# EAGLE design untitled (EAGLE 9.6.1)
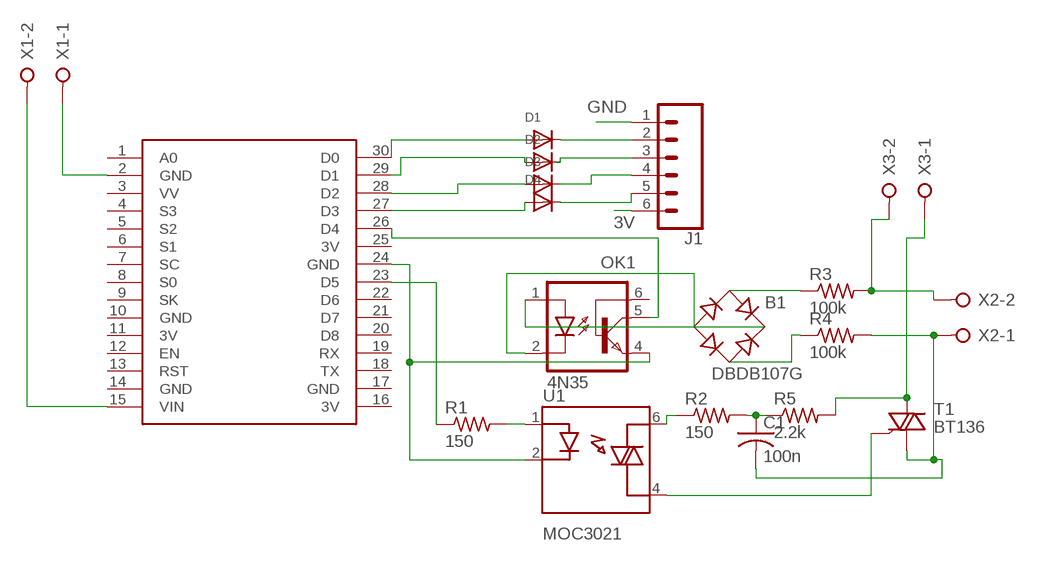
[diagram p0: schematic, sheet 1]

## Parts
B1  DBDB107G  [DB]
C1  100n  C-US050-045X075  [C050-045X075]
D1  DIODEDO-1N4148  [DO-1N4148]
D2  DIODEDO-1N4148  [DO-1N4148]
D3  DIODEDO-1N4148  [DO-1N4148]
D4  DIODEDO-1N4148  [DO-1N4148]
J1  CONN_06LONGPADS  [1X06_LONGPADS]
OK1  4N35  [DIL06]
R1  150  R-US_0207/10  [0207/10]
R2  150  R-US_0207/10  [0207/10]
R3  100k  R-US_0207/10  [0207/10]
R4  100k  R-US_0207/10  [0207/10]
R5  2.2k  R-US_0207/10  [0207/10]
T1  BT136  [TO220AB]
U1  MOC3021  [DIP762W45P254L889H508Q6]
U$1  NODEMCU  [NODEMCU]
X1  W237-02P  [W237-132]
X2  W237-02P  [W237-132]
X3  W237-02P  [W237-132]

## Nets
3V: J1.6
GND: J1.1
N$1: D1.A U$1.30(D0)
N$2: D4.A U$1.27(D3)
N$3: D3.A U$1.28(D2)
N$4: R3.2 X2.2 X3.2
N$5: D3.C J1.4
N$6: U$1.15(VIN) X1.2
N$7: D4.C J1.5
N$8: D1.C J1.2
N$9: U$1.2(GND) X1.1
N$10: D2.A U$1.29(D1)
N$11: D2.C J1.3
N$12: B1.AC1 R3.1
N$14: B1.AC2 R4.1
N$15: T1.3(G) U1.4(MAIN_TERM2)
N$16: B1.- OK1.2(C)
N$17: B1.+ OK1.1(A)
N$18: OK1.4(EMI) U1.2(CATODE) U$1.24(GND)
N$19: OK1.5(COL) U$1.26(D4)
N$20: R1.1 U$1.23(D5)
N$21: R1.2 U1.1(ANODE)
N$22: R2.1 U1.6(MAIN_TERM1)
N$23: C1.1 R2.2 R5.1
N$24: R5.2 T1.2(A2) X3.1
N$25: C1.2 R4.2 T1.1(A1) X2.1
Unconnected: OK1.6(BAS) U$1.1(A0) U$1.3(VV) U$1.4(S3) U$1.5(S2) U$1.6(S1) U$1.7(SC) U$1.8(S0) U$1.9(SK) U$1.12(EN) U$1.13(RST) U$1.18(TX) U$1.19(RX) U$1.20(D8) U$1.21(D7) U$1.22(D6)

## Power pins joined to a net without a drawn wire
3V: U$1.11(3V) U$1.16(3V) U$1.25(3V)
GND: U$1.10(GND) U$1.14(GND) U$1.17(GND)

## Library data of the parts
B1 = rectifier:DB?*G: Single Phase 1.0 AMP Glass Passivated Bridge Rectifier Taiwan Semiconductor Co.,Ltd. - TSC Source: http://www.taiwansemi.com/TSCbig5/ezcatfiles/cust/img/img/db101g.pdf http://www.ts.com.tw/db/pictures/modules/PDT/PDT060207001/DBLS201G.pdf
C1 = adafruit:C-US: CAPACITOR, American symbol
D1-D4 = adafruit:DIODE: Diode SMADIODE - SMA Surface Mount Package 20V 1A Schottky Diode Digikey: 641-1014-6-ND DO-1N4148 - Through Hole Small Current Diode SOD-123 20V 1 A (.5mV Vf) Schottky Diode - Digikey: MBRX120TPMSCT-ND SOD-323 10V 570mA (.38mV Vf, 3ns) Schottky Diode - Digikey: ZLLS410CT-ND SOD-523 30V 30mA Schottky Diode (RB751S-40TE61) - Digikey: RB751S-40TE61CT-ND SOT23-R/W - SOT23 Package (R = Solder Paste/Reflow Ovens, W = Hand-Soldering) BAT54Film 40V 300mA - Digikey: 497-7162-1-ND
J1 = SparkFun-Connectors:CONN_06: Multi connection point. Often used as Generic Header-pin footprint for 0.1 inch spaced/style header connections On any of the 0.1 inch spaced packages, you can populate with these: Break Away Headers - Straight <https://www.sparkfun.com/products/116> (PRT-00116) Break Away Male Headers - Right Angle <https://www.sparkfun.com/products/553> (PRT-00553) Female Headers <https://www.sparkfun.com/products/115> (PRT-00115) Break Away Headers - Machine Pin <https://www.sparkfun.com/products/117> (PRT-00117) Break Away Female Headers - Swiss Machine Pin <https://www.sparkfun.com/products/743> (PRT-00743) Arduino Stackable Header - 6 Pin <https://www.sparkfun.com/products/9280> (PRT-09280) For SCREWTERMINALS and SPRING TERMINALS visit here: Screw Terimnals on SparkFun.com <https://www.sparkfun.com/search/results?term=Screw+Terminals> (5mm/3.5mm/2.54mm spacing) This device is also useful as a general connection point to wire up your design to another part of your project. Our various solder wires solder well into these plated through hole pads. Hook-Up Wire - Assortment (Stranded, 22 AWG) <https://www.sparkfun.com/products/11375> (PRT-11375) Hook-Up Wire - Assortment (Solid Core, 22 AWG) <https://www.sparkfun.com/products/11367> (PRT-11367) View the entire wire category on our website here <https://www.sparkfun.com/categories/141>
OK1 = optocoupler:4N35: MOTOROLA OPTO COUPLER; MF: FAIRCHILD SEMICONDUCTOR; MPN: 4N35; OC_FARNELL: 1328375; OC_NEWARK: 72K9946
R1-R5 = adafruit:R-US_: RESISTOR, American symbol
T1 = triac:BT136: Triac BT136 series E sensitive gate Source: http://www.nxp.com/acrobat_download/datasheets/BT136_SERIES_E_2.pdf
U1 = MOC3021:MOC3021: Optocoupler Triac AC-OUT 1-CH 400VDRM 6-Pin PDIP; AVAILABILITY: Unavailable; DESCRIPTION: Optoisolator Triac Output 4170Vrms 1 Channel 6-SMD; DIGIKEY-PURCHASE-URL: https://snapeda.com/shop?store=DigiKey&id=1666329; MF: ON Semiconductor; MP: MOC3021; PACKAGE: DIP-6 Fujitsu; PRICE: None
U$1 = nodemcu:NODEMCU
X1-X3 = con-wago-508:W237-02P: WAGO SREW CLAMP; OC_FARNELL: unknown; OC_NEWARK: unknown

## Board
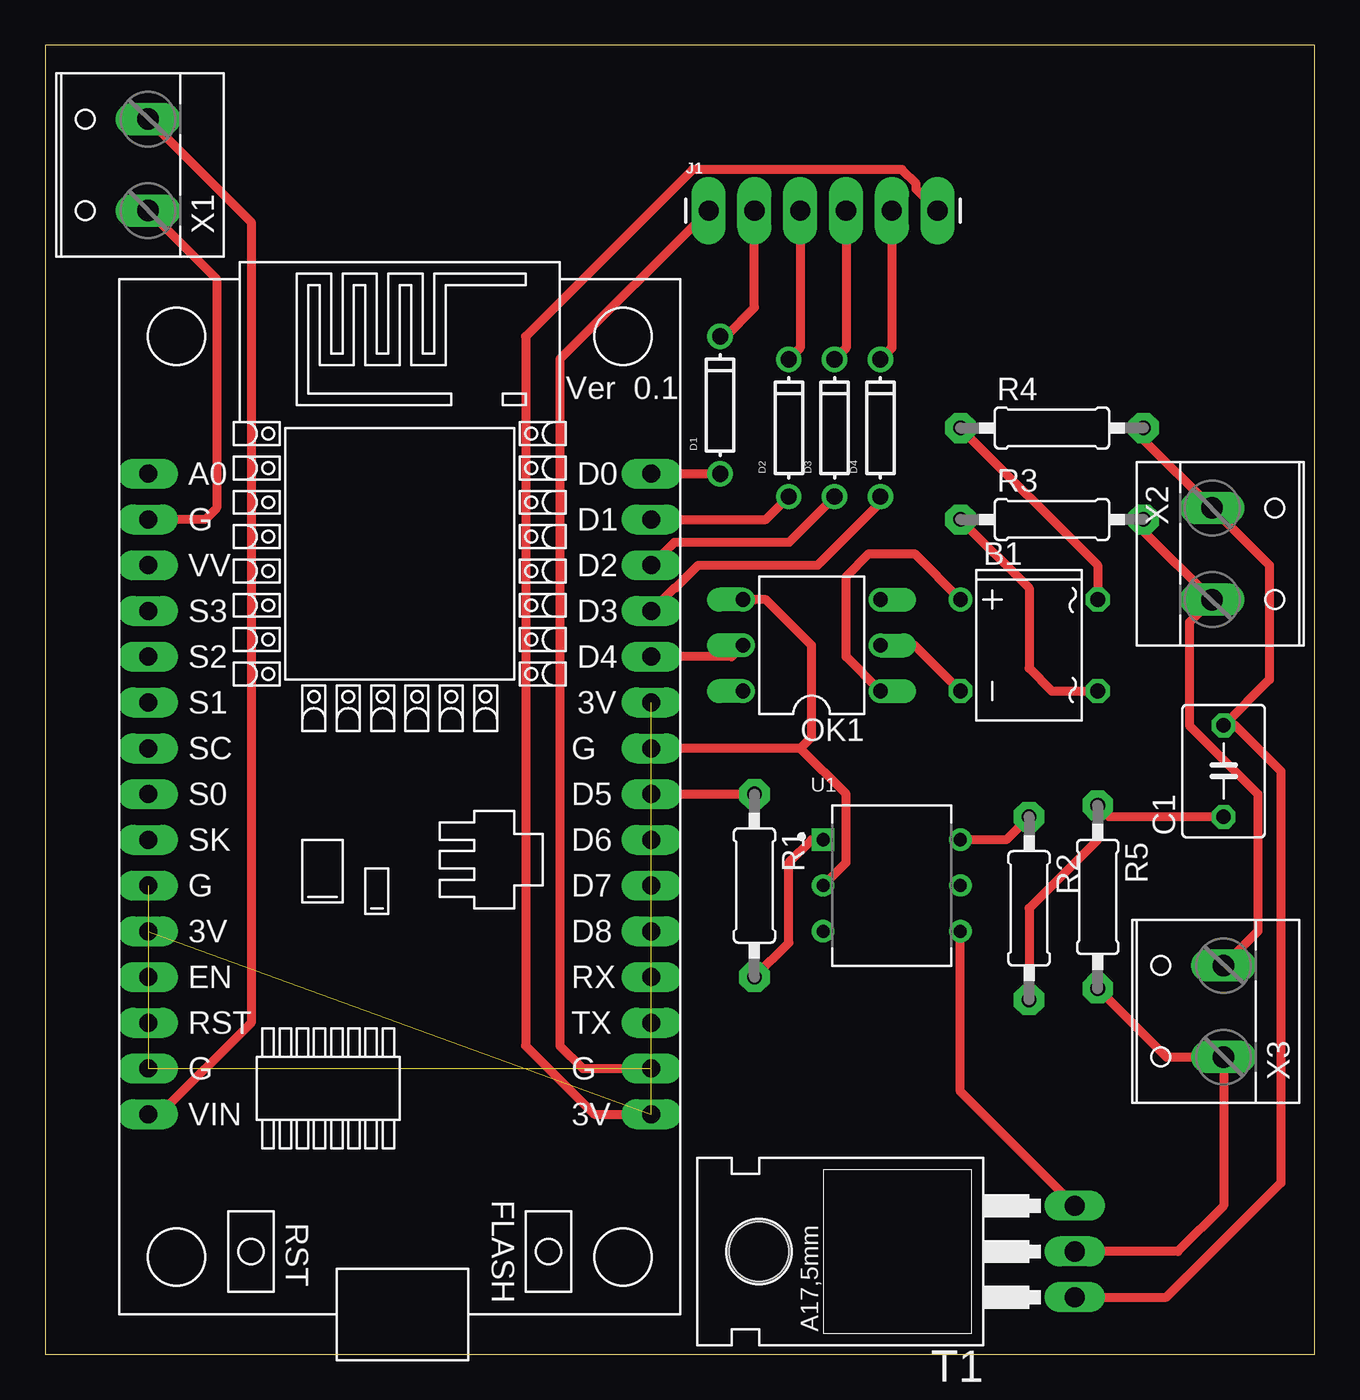
[diagram p1: board, top side]

Size 70.47 x 72.69 mm. Coordinates in mm from the lower left corner, seen from the top.
Outline: 0,0 70.47,0 70.47,72.69 0,72.69 0,0
Copper layers (1*16): Top 0.035mm / dielectric 1.5mm / Bottom 0.035mm
Design rules "default": minimum track width 6mil, minimum drill 0.35mm, track to track 6mil, track to pad 6mil, pad to pad 6mil, via to via 6mil, smd to smd 6mil, copper to edge 40mil, drill to drill 6mil, minimum pad ring 10mil, minimum via ring 8mil, stop-mask expansion 4mil, vias tented up to drill 0mil, thermal gap 10mil

### Footprints (pad centres in the part's own frame; a part is rotated, then mirrored left to right if it is on the bottom)
DB = drill 0.813: + -2.54,-3.81 | drill 0.813 octagon: - 2.54,-3.81; AC1 2.54,3.81; AC2 -2.54,3.81
C050-045X075 = drill 0.813 octagon: 1 -2.54,0; 2 2.54,0
DO-1N4148 = drill 0.9: A -3.81,0; C 3.81,0
1X06_LONGPADS = drill 1.118 pad 1.88 long: 1 0,0; 2 2.54,0; 3 5.08,0; 4 7.62,0; 5 10.16,0; 6 12.7,0
DIL06 = drill 0.813 offset: 1 -2.54,-3.81; 2 0,-3.81; 3 2.54,-3.81; 4 2.54,3.81; 5 0,3.81; 6 -2.54,3.81
0207/10 = drill 0.813 pad 1.676 octagon: 1 -5.08,0; 2 5.08,0
TO220AB = drill 1.118 long: 1 -2.54,-6.35; 2 0,-6.35; 3 2.54,-6.35 | hole 3.302: 0,11.176
DIP762W45P254L889H508Q6 = drill 0.73 pad 1.13 square: 1 -3.81,2.54 | drill 0.73 pad 1.13: 2 -3.81,0; 3 -3.81,-2.54; 4 3.81,-2.54; 5 3.81,0; 6 3.81,2.54
NODEMCU = drill 1 pad 1.676 long: 1 -13.97,17.78; 2 -13.97,15.24; 3 -13.97,12.7; 4 -13.97,10.16; 5 -13.97,7.62; 6 -13.97,5.08; 7 -13.97,2.54; 8 -13.97,0; 9 -13.97,-2.54; 10 -13.97,-5.08; 11 -13.97,-7.62; 12 -13.97,-10.16; 13 -13.97,-12.7; 14 -13.97,-15.24; 15 -13.97,-17.78; 16 13.97,-17.78; 17 13.97,-15.24; 18 13.97,-12.7; 19 13.97,-10.16; 20 13.97,-7.62; 21 13.97,-5.08; 22 13.97,-2.54; 23 13.97,0; 24 13.97,2.54; 25 13.97,5.08; 26 13.97,7.62; 27 13.97,10.16; 28 13.97,12.7; 29 13.97,15.24; 30 13.97,17.78
W237-132 = drill 1.194 long: 1 -2.54,-0.635; 2 2.54,-0.635

### Placement (x,y rotation side)
B1  54.61,39.37 270 top
C1  65.41,32.38 90 top
D1  37.47,52.7 90 top
D2  41.27,51.44 90 top
D3  43.81,51.44 90 top
D4  46.35,51.44 90 top
J1  36.83,63.5 0 top
OK1  42.55,39.37 90 top
R1  39.37,26.04 270 top
R2  54.61,24.77 270 top
R3  55.88,46.35 0 top
R4  55.88,51.44 0 top
R5  58.42,25.4 270 top
T1  50.8,5.71 90 top
U1  46.99,26.04 0 top
U$1  19.68,31.11 0 top
X1  5.08,66.04 90 top
X2  65.41,44.45 270 top
X3  64.77,19.05 90 top

### Tracks (layer width: path | path; a pad name or v marks a point on that pad's centre or on a via)
3V  (2 unrouted)
  Top 0.508: J1.6 48.34,64.69 48.34,65 47.55,65.79 35.94,65.79 26.67,56.52 26.67,17.14 30.48,13.34 U$1.16
GND  (2 unrouted)
  Top 0.508: J1.1 28.57,55.24 28.57,17.14 29.84,15.88 U$1.17
N$1
  Top 0.508: U$1.30 D1.A
N$2
  Top 0.508: U$1.27 34.95,42.57 35.01,42.57 36.25,43.81 42.88,43.81 46.35,47.29 D4.A
N$3
  Top 0.508: D3.A 41.27,45.09 34.92,45.09 U$1.28
N$4
  Top 0.508: R3.2 60.96,45.72 X2.2 63.5,40.64 63.5,34.92 67.31,31.11 67.31,23.5 X3.2
N$5
  Top 0.508: J1.4 44.45,55.88 D3.C
N$6
  Top 0.508: X1.2 11.43,62.87 11.43,18.41 6.35,13.34 U$1.15
N$7
  Top 0.508: J1.5 46.99,55.88 D4.C
N$8
  Top 0.508: J1.2 39.37,58.12 37.77,56.52 D1.C
N$9
  Top 0.508: X1.1 9.53,59.69 9.53,46.99 8.89,46.35 U$1.2
N$10
  Top 0.508: D2.A 40.01,46.35 U$1.29
N$11
  Top 0.508: J1.3 41.91,55.88 D2.C
N$12
  Top 0.508: R3.1 54.61,42.55 54.61,38.1 55.88,36.83 B1.AC1
N$14
  Top 0.508: R4.1 58.42,43.81 B1.AC2
N$15
  Top 0.508: T1.3 50.8,14.61 U1.4
N$16
  Top 0.508: OK1.2 48.26,39.37 B1.-
N$17
  Top 0.508: OK1.1 44.45,38.73 44.45,43.18 45.72,44.45 48.26,44.45 B1.+
N$18
  Top 0.508: U1.2 44.45,27.3 44.45,31.11 41.91,33.66 | 41.91,33.66 U$1.24 | 41.91,33.66 42.55,34.29 42.55,39.37 40.01,41.91 OK1.4 39.37,41.91
N$19
  Top 0.508: OK1.5 38.1,38.73 U$1.26
N$20
  Top 0.508: U$1.23 R1.1
N$21
  Top 0.508: R1.2 41.27,22.86 41.27,27.3 42.55,28.57 U1.1
N$22
  Top 0.508: R2.1 53.34,28.57 U1.6
N$23
  Top 0.508: C1.1 59.05,29.84 R5.1 58.42,28.57 54.61,24.77 R2.2
N$24
  Top 0.508: R5.2 62.23,16.51 X3.1 65.41,8.26 62.87,5.71 T1.2
N$25
  Top 0.508: R4.2 60.96,50.8 X2.1 67.94,43.81 67.94,37.47 C1.2 66.04,34.92 68.58,32.38 68.58,9.53 62.23,3.17 T1.1